# Altium schematic sheet FPGA.SchDoc: FPGA
size A3; DocumentNumber: 9; Revision: 2.0; SheetNumber: 9; SheetTotal: 18
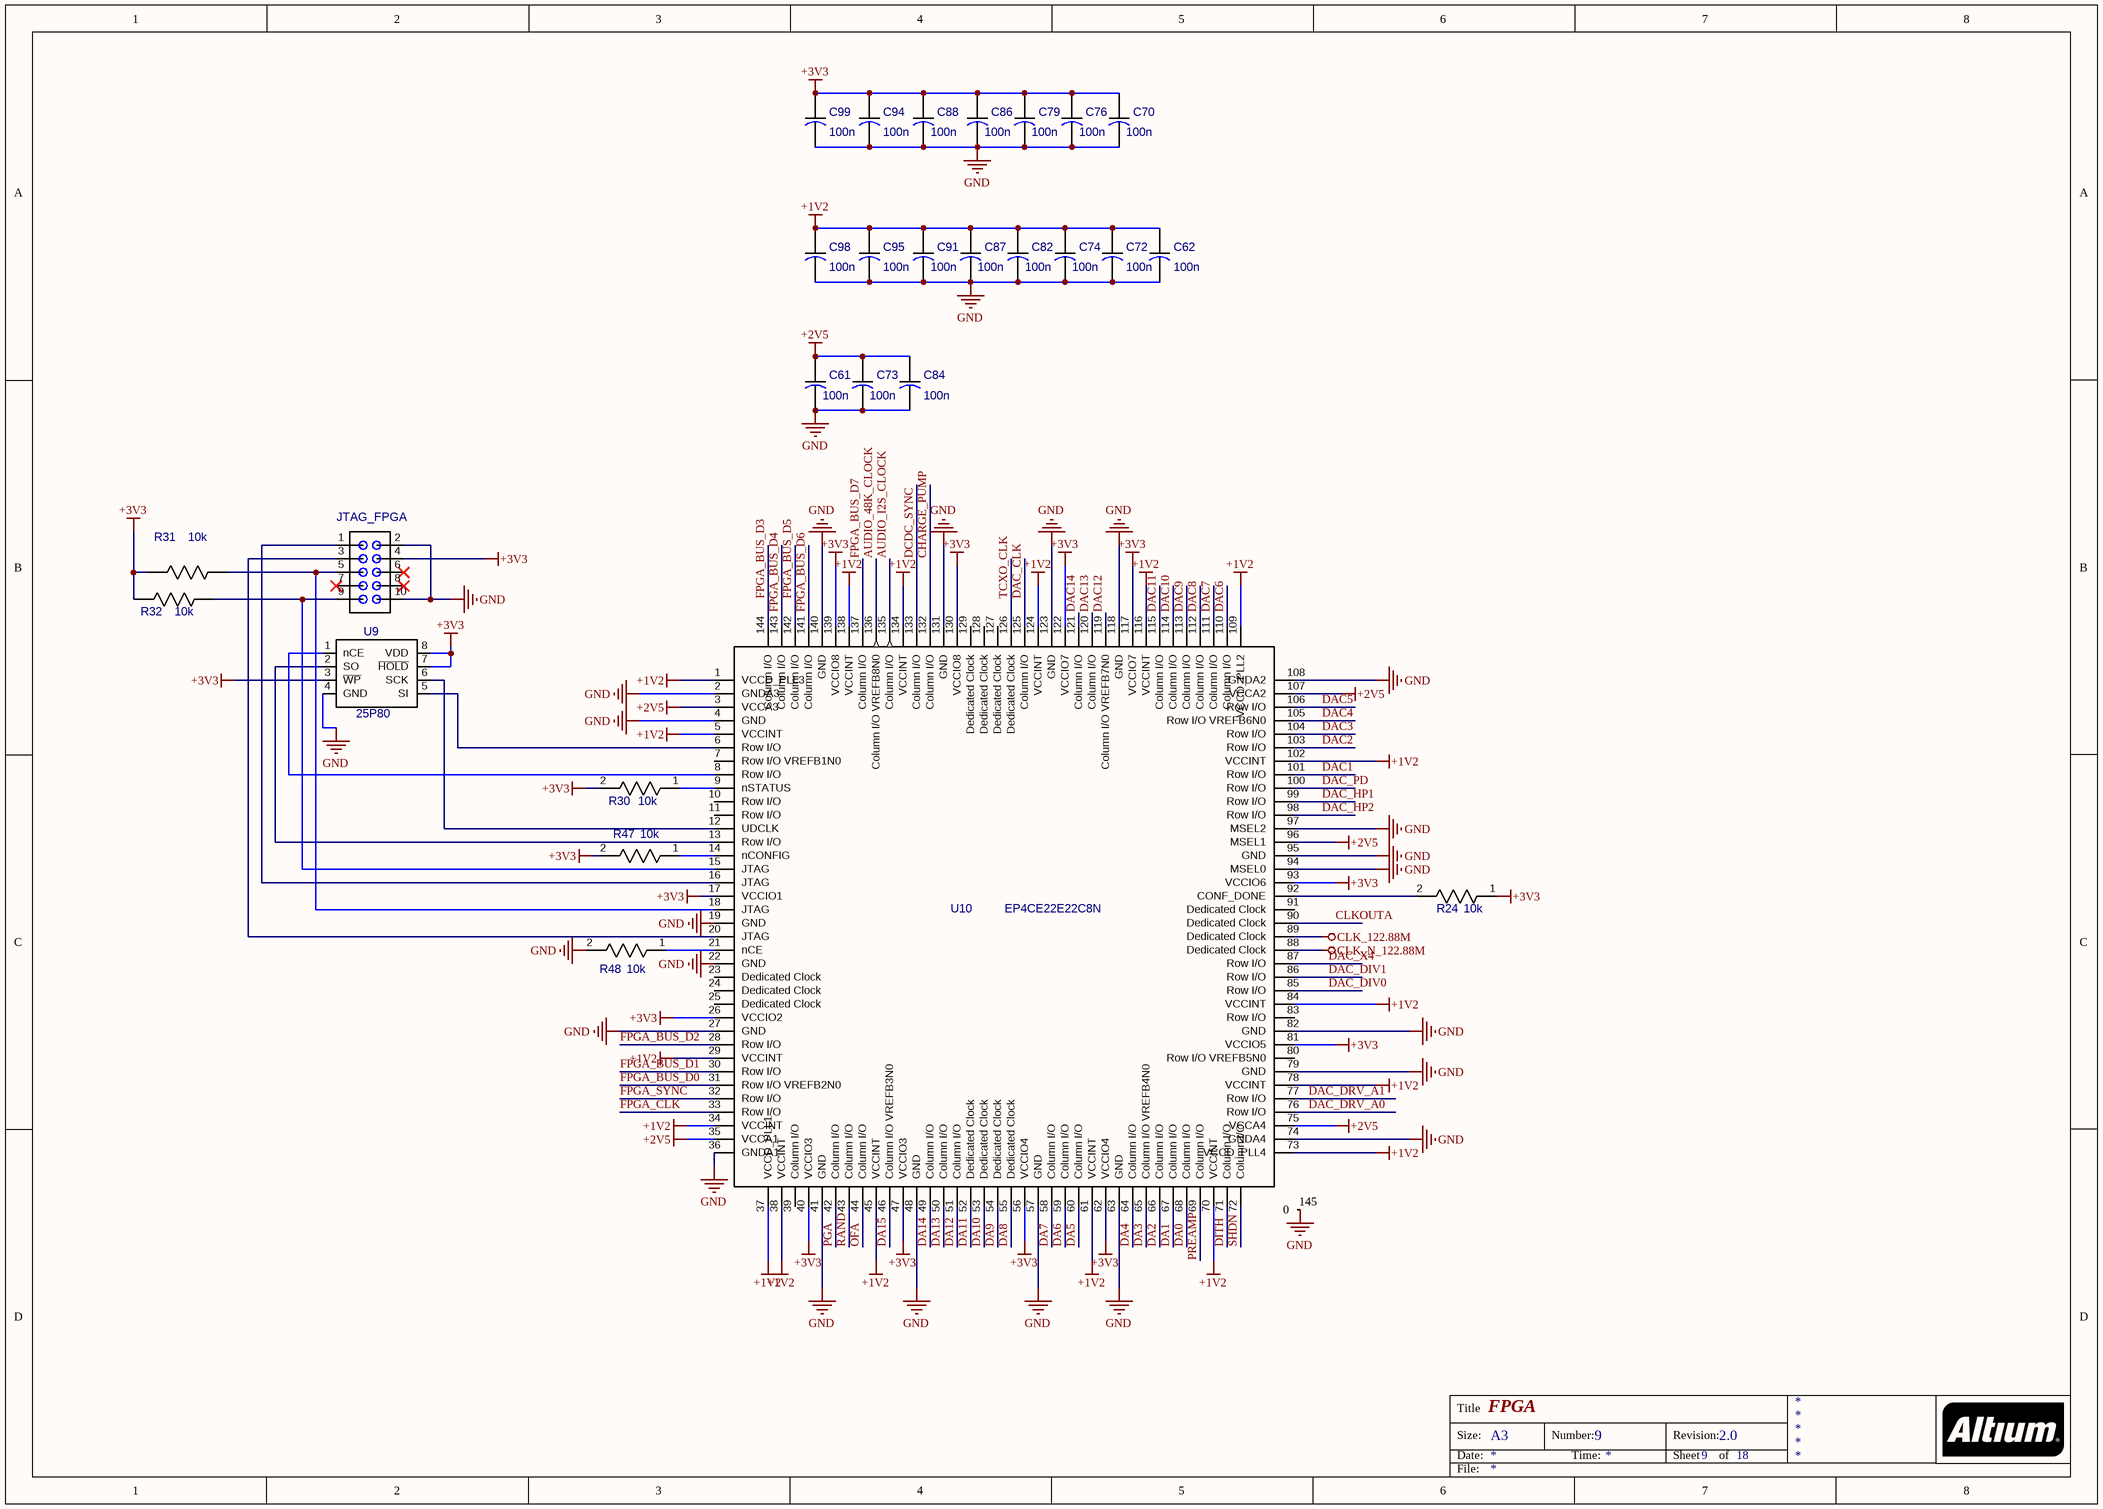
[diagram p0: FPGA.SchDoc]

## Parts
C61  100n  [CAP_0805]
C62  100n  [CAP_0805]
C70  100n  [CAP_0805]
C72  100n  [CAP_0805]
C73  100n  [CAP_0805]
C74  100n  [CAP_0805]
C76  100n  [CAP_0805]
C79  100n  [CAP_0805]
C82  100n  [CAP_0805]
C84  100n  [CAP_0805]
C86  100n  [CAP_0805]
C87  100n  [CAP_0805]
C88  100n  [CAP_0805]
C91  100n  [CAP_0805]
C94  100n  [CAP_0805]
C95  100n  [CAP_0805]
C98  100n  [CAP_0805]
C99  100n  [CAP_0805]
JTAG_FPGA  (no value)  [IDC10]
R24  10k  [RES_0805]
R30  10k  [RES_0805]
R31  10k  [RES_0805]
R32  10k  [RES_0805]
R47  10k  [RES_0805]
R48  10k  [RES_0805]
U9  25P80  [25P80]
U10  EP4CE22E22C8N  [QFP144-20-2222A]

## Nets
+1V2: C62.1 C72.1 C74.1 C82.1 C87.1 C91.1 C95.1 C98.1 U10.1(VCCD_PLL3) U10.5(VCCINT) U10.29(VCCINT) U10.34(VCCINT) U10.37(VCCD_PLL1) U10.38(VCCINT) U10.45(VCCINT) U10.61(VCCINT) U10.70(VCCINT) U10.73(VCCD_PLL4) U10.78(VCCINT) U10.84(VCCINT) U10.102(VCCINT) U10.109(VCCD_PLL2) U10.116(VCCINT) U10.124(VCCINT) U10.134(VCCINT) U10.138(VCCINT)
+2V5: C61.1 C73.1 C84.1 U10.3(VCCA3) U10.35(VCCA1) U10.75(VCCA4) U10.96(MSEL1) U10.107(VCCA2)
+3V3: C70.1 C76.1 C79.1 C86.1 C88.1 C94.1 C99.1 JTAG_FPGA.4 R24.1 R30.2 R31.2 R32.2 R47.2 U9.3(~{WP}) U9.7(~{HOLD}) U9.8(VDD) U10.17(VCCIO1) U10.26(VCCIO2) U10.40(VCCIO3) U10.47(VCCIO3) U10.56(VCCIO4) U10.62(VCCIO4) U10.81(VCCIO5) U10.93(VCCIO6) U10.117(VCCIO7) U10.122(VCCIO7) U10.130(VCCIO8) U10.139(VCCIO8)
CLK_122.88M: U10.89(Dedicated_Clock)
CLK_N_122.88M: U10.88(Dedicated_Clock)
GND: C61.2 C62.2 C70.2 C72.2 C73.2 C74.2 C76.2 C79.2 C82.2 C84.2 C86.2 C87.2 C88.2 C91.2 C94.2 C95.2 C98.2 C99.2 JTAG_FPGA.2 JTAG_FPGA.10 R48.2 U9.4(GND) U10.2(GNDA3) U10.4(GND) U10.19(GND) U10.22(GND) U10.27(GND) U10.36(GNDA1) U10.41(GND) U10.48(GND) U10.57(GND) U10.63(GND) U10.74(GNDA4) U10.79(GND) U10.82(GND) U10.94(MSEL0) U10.95(GND) U10.97(MSEL2) U10.108(GNDA2) U10.118(GND) U10.123(GND) U10.131(GND) U10.140(GND) U10.145(0)
AUDIO_48K_CLOCK: U10.136(Column_I/O_VREFB8N0)
AUDIO_I2S_CLOCK: U10.135(Column_I/O)
CHARGE_PUMP: U10.132(Column_I/O)
CLKOUTA: U10.90(Dedicated_Clock)
DA0: U10.68(Column_I/O)
DA1: U10.67(Column_I/O)
DA2: U10.66(Column_I/O)
DA3: U10.65(Column_I/O_VREFB4N0)
DA4: U10.64(Column_I/O)
DA5: U10.60(Column_I/O)
DA6: U10.59(Column_I/O)
DA7: U10.58(Column_I/O)
DA8: U10.55(Dedicated_Clock)
DA9: U10.54(Dedicated_Clock)
DA10: U10.53(Dedicated_Clock)
DA11: U10.52(Dedicated_Clock)
DA12: U10.51(Column_I/O)
DA13: U10.50(Column_I/O)
DA14: U10.49(Column_I/O)
DA15: U10.46(Column_I/O_VREFB3N0)
DAC1: U10.101(Row_I/O)
DAC2: U10.103(Row_I/O)
DAC3: U10.104(Row_I/O)
DAC4: U10.105(Row_I/O_VREFB6N0)
DAC5: U10.106(Row_I/O)
DAC6: U10.110(Column_I/O)
DAC7: U10.111(Column_I/O)
DAC8: U10.112(Column_I/O)
DAC9: U10.113(Column_I/O)
DAC10: U10.114(Column_I/O)
DAC11: U10.115(Column_I/O)
DAC12: U10.119(Column_I/O_VREFB7N0)
DAC13: U10.120(Column_I/O)
DAC14: U10.121(Column_I/O)
DAC_CLK: U10.125(Column_I/O)
DAC_DIV0: U10.85(Row_I/O)
DAC_DIV1: U10.86(Row_I/O)
DAC_DRV_A0: U10.76(Row_I/O)
DAC_DRV_A1: U10.77(Row_I/O)
DAC_HP1: U10.99(Row_I/O)
DAC_HP2: U10.98(Row_I/O)
DAC_PD: U10.100(Row_I/O)
DAC_X4: U10.87(Row_I/O)
DCDC_SYNC: U10.133(Column_I/O)
DITH: U10.71(Column_I/O)
FPGA_BUS_D0: U10.31(Row_I/O_VREFB2N0)
FPGA_BUS_D1: U10.30(Row_I/O)
FPGA_BUS_D2: U10.28(Row_I/O)
FPGA_BUS_D3: U10.144(Column_I/O)
FPGA_BUS_D4: U10.143(Column_I/O)
FPGA_BUS_D5: U10.142(Column_I/O)
FPGA_BUS_D6: U10.141(Column_I/O)
FPGA_BUS_D7: U10.137(Column_I/O)
FPGA_CLK: U10.33(Row_I/O)
FPGA_SYNC: U10.32(Row_I/O)
OFA: U10.44(Column_I/O)
PGA: U10.42(Column_I/O)
PREAMP: U10.69(Column_I/O)
RAND: U10.43(Column_I/O)
SHDN: U10.72(Column_I/O)
TCXO_CLK: U10.126(Dedicated_Clock)
NetJTAG_FPGA_1: JTAG_FPGA.1 U10.16(JTAG)
NetJTAG_FPGA_3: JTAG_FPGA.3 U10.20(JTAG)
NetJTAG_FPGA_5: JTAG_FPGA.5 R31.1 U10.18(JTAG)
NetJTAG_FPGA_9: JTAG_FPGA.9 R32.1 U10.15(JTAG)
NetR24_2: R24.2 U10.92(CONF_DONE)
NetR30_1: R30.1 U10.9(nSTATUS)
NetR47_1: R47.1 U10.14(nCONFIG)
NetR48_1: R48.1 U10.21(nCE)
NetU9_1: U9.1(nCE) U10.8(Row_I/O)
NetU9_2: U9.2(SO) U10.13(Row_I/O)
NetU9_5: U9.5(SI) U10.6(Row_I/O)
NetU9_6: U9.6(SCK) U10.12(UDCLK)

Not connected (* = marked no-connect by the designer): JTAG_FPGA 6* 7* 8*; U10 7(Row_I/O_VREFB1N0) 10(Row_I/O) 11(Row_I/O) 23(Dedicated_Clock) 24(Dedicated_Clock) 25(Dedicated_Clock) 39(Column_I/O) 80(Row_I/O_VREFB5N0) 83(Row_I/O) 91(Dedicated_Clock) 127(Dedicated_Clock) 128(Dedicated_Clock) 129(Dedicated_Clock)

## Notes on the sheet
- Title
- Size:
- Date:
- A3
- Number:
- Time:
- Revision:
- Sheet
- of
- File:

## Library data of the parts
C61 C62 C70 C72-C74 C76 C79 C82 C84 C86-C88 C91 C94 C95 C98 C99 = CAP_0805: Value: 100n
JTAG_FPGA = IDC10: 2*5 Pin
R24 R30-R32 R47 R48 = RES_0805: Value: 10k
U9 = 25P80: Value: 25P80
U10 = EP4CE22E22C8N: Value: EP4CE22E22C8N